# EAGLE design 433_1 (EAGLE 9.2.2)
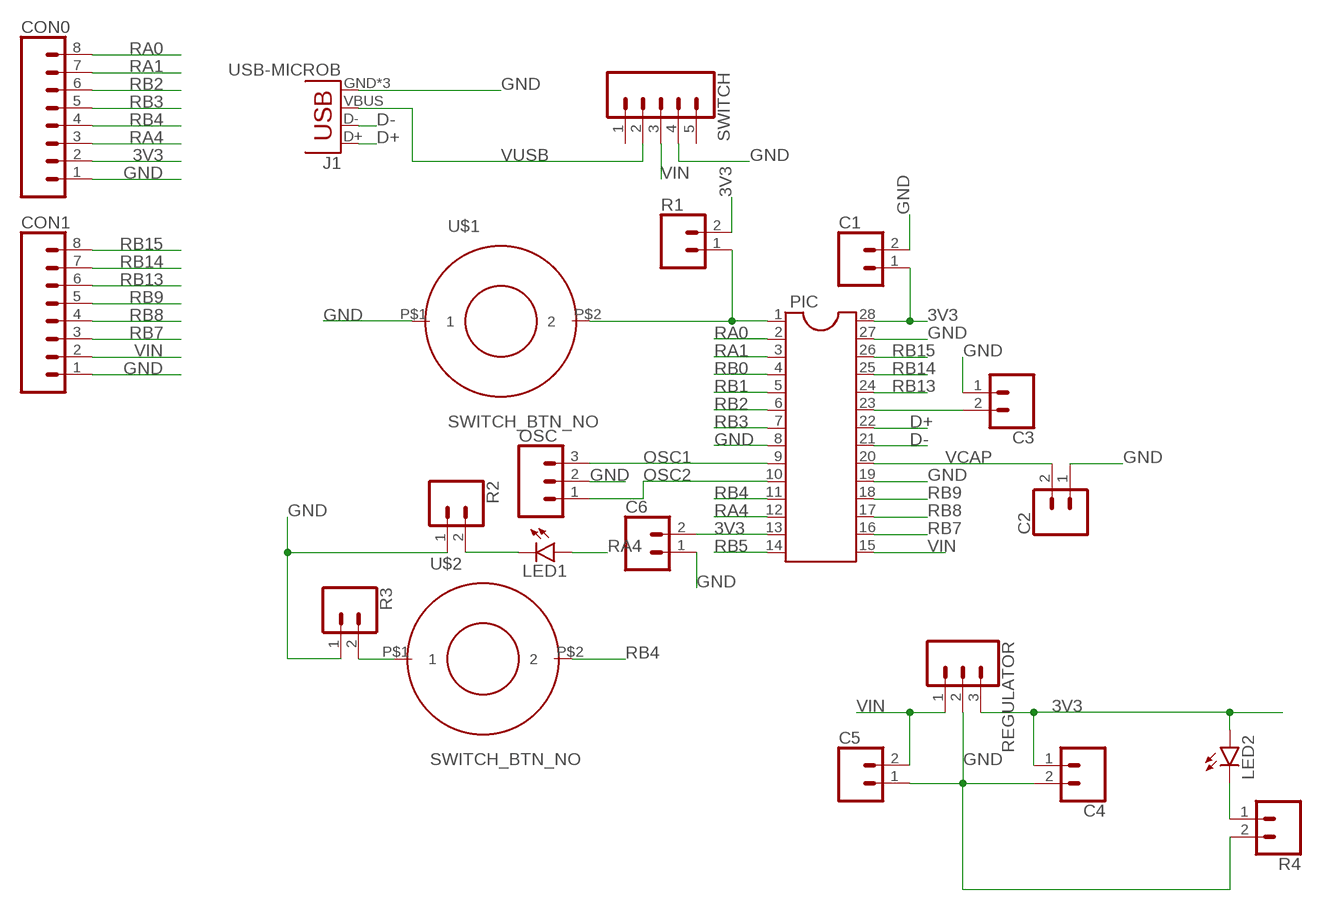
[diagram p0: schematic, sheet 1]

## Parts
C1  CONN_02  [1X02]
C2  CONN_02  [1X02]
C3  CONN_02  [1X02]
C4  CONN_02  [1X02]
C5  CONN_02  [1X02]
C6  CONN_02  [1X02]
CON0  CONN_08"  [1X08]
CON1  CONN_08"  [1X08]
J1  USB-MICROB  [USB-MICROB]
LED1  LED3MM  [LED3MM]
LED2  LED3MM  [LED3MM]
OSC  CONN_03  [1X03]
PIC  DIL28-4  [DIL28-4]
R1  CONN_02  [1X02]
R2  CONN_02  [1X02]
R3  CONN_02  [1X02]
R4  CONN_02  [1X02]
REGULATOR  CONN_03  [1X03]
SWITCH  CONN_05  [1X05]
U$1  SWITCH_BTN_NO  [BTN_2]
U$2  SWITCH_BTN_NO  [BTN_2]

## Nets
3V3: C1.1 C3.2 C4.1 C6.2 CON0.2 LED2.A PIC.13 PIC.23 PIC.28 R1.2 REGULATOR.3
D+: J1.D+ PIC.22
D-: J1.D- PIC.21
GND: C1.2 C2.1 C3.1 C4.2 C5.1 C6.1 CON0.1 CON1.1 J1.GND J1.MT1(GND) J1.MT2(GND) OSC.2 PIC.8 PIC.19 PIC.27 R2.1 R3.1 R4.2 REGULATOR.2 SWITCH.4 U$1.P$1
N$1: LED1.K(C) R2.2
N$2: R3.2 U$2.P$1
N$5: LED2.K(C) R4.1
N$6: PIC.1 R1.1 U$1.P$2
OSC1: OSC.3 PIC.9
OSC2: OSC.1 PIC.10
RA0: CON0.8 PIC.2
RA1: CON0.7 PIC.3
RA4: CON0.3 LED1.A PIC.12
RB0: PIC.4
RB1: PIC.5
RB2: CON0.6 PIC.6
RB3: CON0.5 PIC.7
RB4: CON0.4 PIC.11 U$2.P$2
RB5: PIC.14
RB7: CON1.3 PIC.16
RB8: CON1.4 PIC.17
RB9: CON1.5 PIC.18
RB13: CON1.6 PIC.24
RB14: CON1.7 PIC.25
RB15: CON1.8 PIC.26
VCAP: C2.2 PIC.20
VIN: C5.2 CON1.2 PIC.15 REGULATOR.1 SWITCH.3
VUSB: J1.VBUS SWITCH.2
Unconnected: SWITCH.1 SWITCH.5

## Library data of the parts
C1-C6 R1-R4 = SparkFun-Connectors:CONN_02: Multi connection point. Often used as Generic Header-pin footprint for 0.1 inch spaced/style header connections On any of the 0.1 inch spaced packages, you can populate with these: Break Away Headers - Straight <https://www.sparkfun.com/products/116> (PRT-00116) Break Away Male Headers - Right Angle <https://www.sparkfun.com/products/553> (PRT-00553) Female Headers <https://www.sparkfun.com/products/115> (PRT-00115) Break Away Headers - Machine Pin <https://www.sparkfun.com/products/117> (PRT-00117) Break Away Female Headers - Swiss Machine Pin <https://www.sparkfun.com/products/743> (PRT-00743) For SCREWTERMINALS and SPRING TERMINALS visit here: Screw Terimnals on SparkFun.com <https://www.sparkfun.com/search/results?term=Screw+Terminals> (5mm/3.5mm/2.54mm spacing) This device is also useful as a general connection point to wire up your design to another part of your project. Our various solder wires solder well into these plated through hole pads. Hook-Up Wire - Assortment (Stranded, 22 AWG) <https://www.sparkfun.com/products/11375> (PRT-11375) Hook-Up Wire - Assortment (Solid Core, 22 AWG) <https://www.sparkfun.com/products/11367> (PRT-11367) View the entire wire category on our website here <https://www.sparkfun.com/categories/141> Special notes: Molex polarized connector foot print use with: PRT-08233 with associated crimp pins and housings. 2.54_SCREWTERM for use with PRT-10571. 3.5mm Screw Terminal footprints for PRT-08084 5mm Screw Terminal footprints for use with PRT-08432
CON0 CON1 = SparkFun-Connectors:CONN_08: Multi connection point. Often used as Generic Header-pin footprint for 0.1 inch spaced/style header connections On any of the 0.1 inch spaced packages, you can populate with these: Break Away Headers - Straight <https://www.sparkfun.com/products/116> (PRT-00116) Break Away Male Headers - Right Angle <https://www.sparkfun.com/products/553> (PRT-00553) Female Headers <https://www.sparkfun.com/products/115> (PRT-00115) Break Away Headers - Machine Pin <https://www.sparkfun.com/products/117> (PRT-00117) Break Away Female Headers - Swiss Machine Pin <https://www.sparkfun.com/products/743> (PRT-00743) Arduino Stackable Header - 8 Pin <https://www.sparkfun.com/products/9279> (PRT-09279) For SCREWTERMINALS and SPRING TERMINALS visit here: Screw Terimnals on SparkFun.com <https://www.sparkfun.com/search/results?term=Screw+Terminals> (5mm/3.5mm/2.54mm spacing) This device is also useful as a general connection point to wire up your design to another part of your project. Our various solder wires solder well into these plated through hole pads. Hook-Up Wire - Assortment (Stranded, 22 AWG) <https://www.sparkfun.com/products/11375> (PRT-11375) Hook-Up Wire - Assortment (Solid Core, 22 AWG) <https://www.sparkfun.com/products/11367> (PRT-11367) View the entire wire category on our website here <https://www.sparkfun.com/categories/141> Special notes: Molex polarized connector foot print use with SKU : PRT-08231 with associated crimp pins and housings. 1MM SMD Version SKU: PRT-10208 NOTES ON THE VARIANTS LOCK and LOCK_LONGPADS... This footprint was designed to help hold the alignment of a through-hole component (i.e. 6-pin header) while soldering it into place. You may notice that each hole has been shifted either up or down by 0.005 of an inch from it's more standard position (which is a perfectly straight line). This slight alteration caused the pins (the squares in the middle) to touch the edges of the holes. Because they are alternating, it causes a "brace" to hold the component in place. 0.005 has proven to be the perfect amount of "off-center" position when using our standard breakaway headers. Although looks a little odd when you look at the bare footprint, once you have a header in there, the alteration is very hard to notice. Also,if you push a header all the way into place, it is covered up entirely on the bottom side.; PROD_ID: CONN-08438
J1 = SparkFun-Retired:USB: USB Connectors USB-B-PTH is fully proven SKU : PRT-00139/CONN-08278 USB-miniB is fully proven SKU : PRT-00587 USB-A-PCB is untested. USB-A-H is throughly reviewed, but untested. Spark Fun Electronics SKU : PRT-00437 USB-B-SMT is throughly reviewed, but untested. Needs silkscreen touching up. USB-A-S has not been used/tested USB-MB-H has not been used/tested USB-MICROB has been used. CONN-09505; PROD_ID: CONN-09505
LED1 LED2 = Ilya_Teach:LED: LEDs Standard schematic elements and footprints for 5mm, 3mm, 1206, and 0603 sized LEDs. 5mm - Spark Fun Electronics SKU : COM-00529 (and others)
OSC REGULATOR = SparkFun-Connectors:CONN_03: Multi connection point. Often used as Generic Header-pin footprint for 0.1 inch spaced/style header connections On any of the 0.1 inch spaced packages, you can populate with these: Break Away Headers - Straight <https://www.sparkfun.com/products/116> (PRT-00116) Break Away Male Headers - Right Angle <https://www.sparkfun.com/products/553> (PRT-00553) Female Headers <https://www.sparkfun.com/products/115> (PRT-00115) Break Away Headers - Machine Pin <https://www.sparkfun.com/products/117> (PRT-00117) Break Away Female Headers - Swiss Machine Pin <https://www.sparkfun.com/products/743> (PRT-00743) Stackable Header - 3 Pin (Female, 0.1") <https://www.sparkfun.com/products/13875> (PRT-13875) For SCREWTERMINALS and SPRING TERMINALS visit here: Screw Terimnals on SparkFun.com <https://www.sparkfun.com/search/results?term=Screw+Terminals> (5mm/3.5mm/2.54mm spacing) This device is also useful as a general connection point to wire up your design to another part of your project. Our various solder wires solder well into these plated through hole pads. Hook-Up Wire - Assortment (Stranded, 22 AWG) <https://www.sparkfun.com/products/11375> (PRT-11375) Hook-Up Wire - Assortment (Solid Core, 22 AWG) <https://www.sparkfun.com/products/11367> (PRT-11367) View the entire wire category on our website here <https://www.sparkfun.com/categories/141> Special notes: Molex polarized connector foot print use with SKU : PRT-08232 with associated crimp pins and housings.
PIC = ic-package:DIL28: Dual In Line
SWITCH = SparkFun-Connectors:CONN_05: Multi connection point. Often used as Generic Header-pin footprint for 0.1 inch spaced/style header connections On any of the 0.1 inch spaced packages, you can populate with these: Break Away Headers - Straight <https://www.sparkfun.com/products/116> (PRT-00116) Break Away Male Headers - Right Angle <https://www.sparkfun.com/products/553> (PRT-00553) Female Headers <https://www.sparkfun.com/products/115> (PRT-00115) Break Away Headers - Machine Pin <https://www.sparkfun.com/products/117> (PRT-00117) Break Away Female Headers - Swiss Machine Pin <https://www.sparkfun.com/products/743> (PRT-00743) For SCREWTERMINALS and SPRING TERMINALS visit here: Screw Terimnals on SparkFun.com <https://www.sparkfun.com/search/results?term=Screw+Terminals> (5mm/3.5mm/2.54mm spacing) This device is also useful as a general connection point to wire up your design to another part of your project. Our various solder wires solder well into these plated through hole pads. Hook-Up Wire - Assortment (Stranded, 22 AWG) <https://www.sparkfun.com/products/11375> (PRT-11375) Hook-Up Wire - Assortment (Solid Core, 22 AWG) <https://www.sparkfun.com/products/11367> (PRT-11367) View the entire wire category on our website here <https://www.sparkfun.com/categories/141> Special notes: Molex polarized connector foot print use with SKU : PRT-08231 with associated crimp pins and housings. 1MM SMD Version SKU: PRT-10208
U$1 U$2 = Ilya_Teach:SWITCH_BTN_NO

## Board
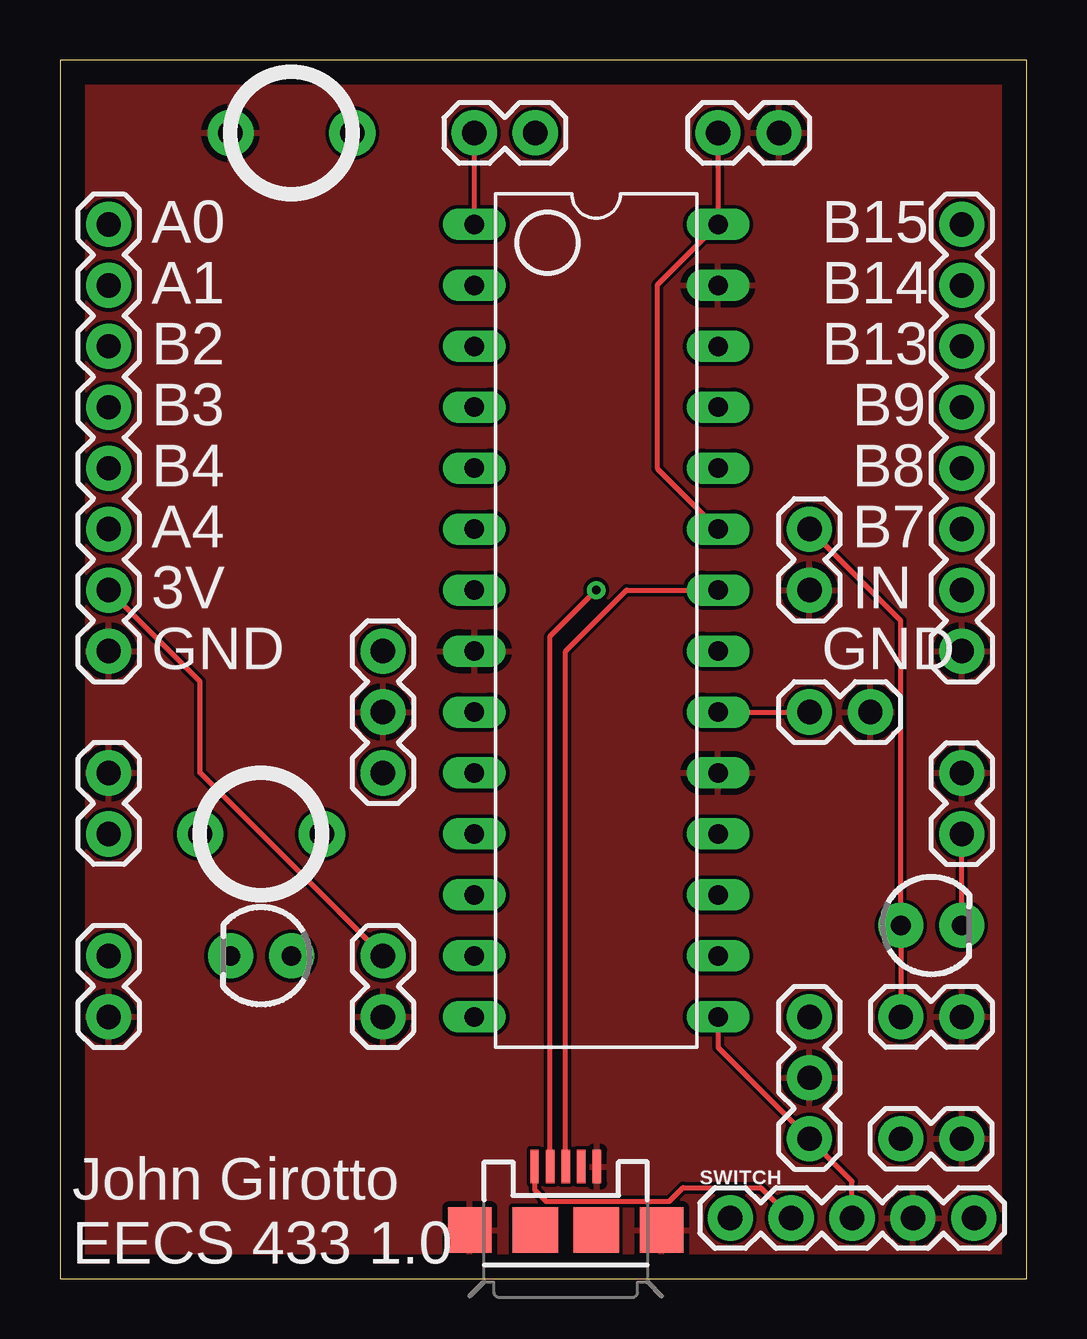
[diagram p1: board, top side]
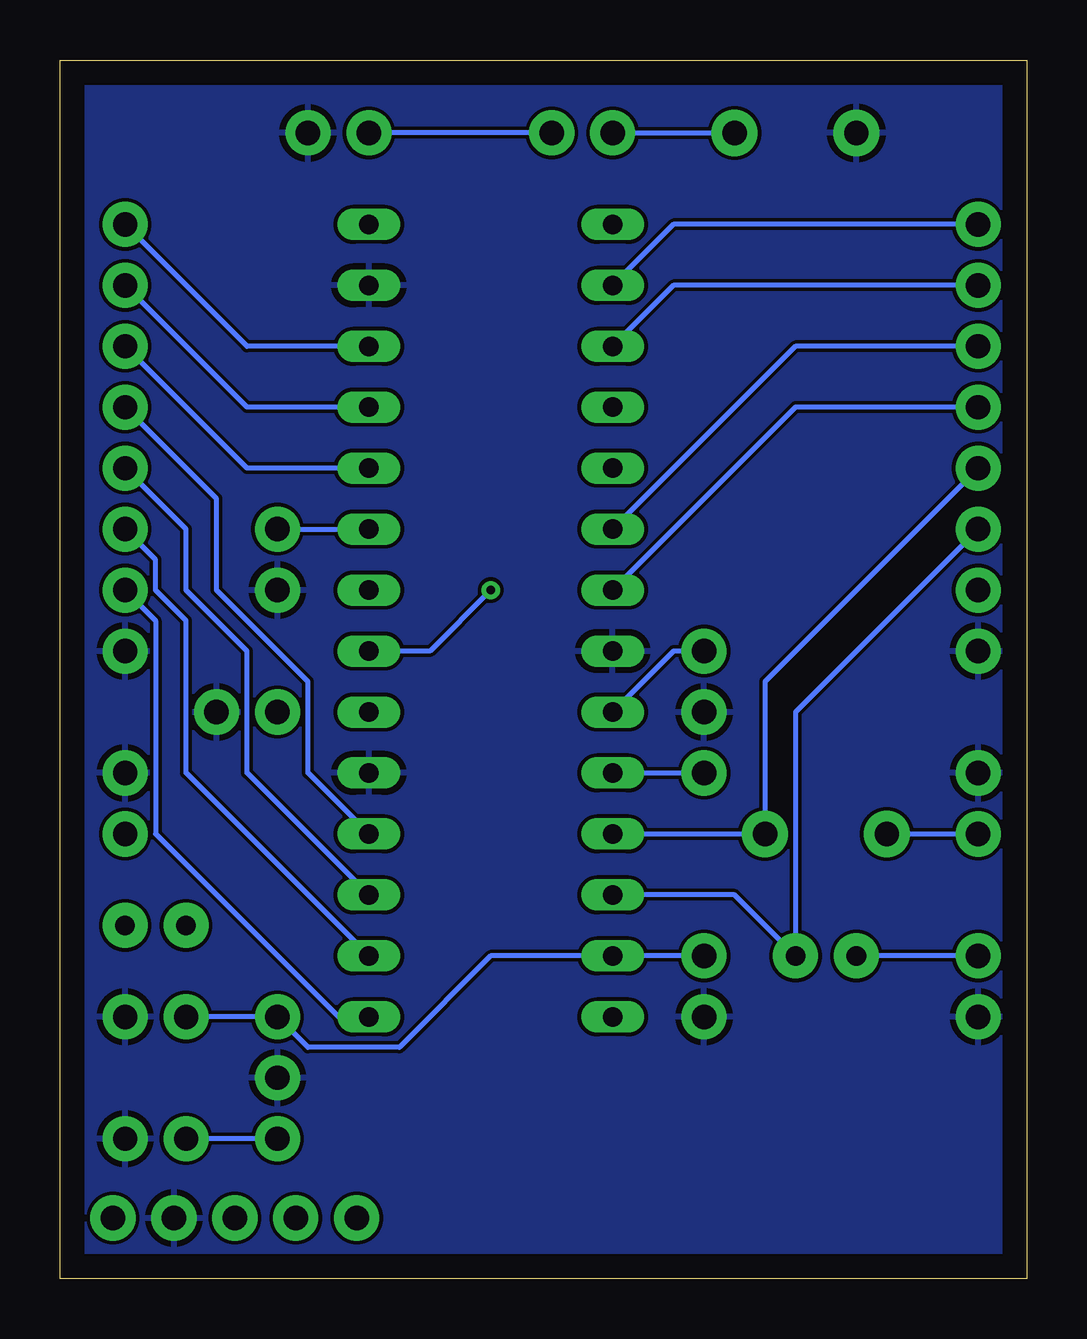
[diagram p2: board, bottom side, seen from below]

Size 40.31 x 50.79 mm. Coordinates in mm from the lower left corner, seen from the top.
Outline: 0,0 40.31,0 40.31,50.79 0,50.79 0,0
Copper layers (1*16): Top 0.035mm / dielectric 1.5mm / Bottom 0.035mm
Design rules "default": minimum track width 6mil, minimum drill 0.35mm, track to track 6mil, track to pad 6mil, pad to pad 6mil, via to via 6mil, smd to smd 6mil, copper to edge 40mil, drill to drill 6mil, minimum pad ring 10mil, minimum via ring 8mil, stop-mask expansion 4mil, vias tented up to drill 0mil, thermal gap 10mil

### Footprints (pad centres in the part's own frame; a part is rotated, then mirrored left to right if it is on the bottom)
1X02 = drill 1.016 pad 1.88: 1 0,0; 2 2.54,0
1X08 = drill 1.016 pad 1.88: 1 0,0; 2 2.54,0; 3 5.08,0; 4 7.62,0; 5 10.16,0; 6 12.7,0; 7 15.24,0; 8 17.78,0
USB-MICROB = smd 0.35 x 1.4: D+ 0,2.65; D- -0.65,2.65; GND 1.3,2.65; ID 0.65,2.65; VBUS -1.3,2.65 | smd 1.8 x 1.9: MT1 -4,0; MT2 4,0 | smd 1.9 x 1.9: P$1 -1.27,0; P$2 1.27,0
LED3MM = drill 0.813 pad 1.88: A -1.27,0; K 1.27,0
1X03 = drill 1.016 pad 1.88: 1 0,0; 2 2.54,0; 3 5.08,0
DIL28-4 = drill 0.813 long: 1 -16.51,-5.08; 2 -13.97,-5.08; 3 -11.43,-5.08; 4 -8.89,-5.08; 5 -6.35,-5.08; 6 -3.81,-5.08; 7 -1.27,-5.08; 8 1.27,-5.08; 9 3.81,-5.08; 10 6.35,-5.08; 11 8.89,-5.08; 12 11.43,-5.08; 13 13.97,-5.08; 14 16.51,-5.08; 15 16.51,5.08; 16 13.97,5.08; 17 11.43,5.08; 18 8.89,5.08; 19 6.35,5.08; 20 3.81,5.08; 21 1.27,5.08; 22 -1.27,5.08; 23 -3.81,5.08; 24 -6.35,5.08; 25 -8.89,5.08; 26 -11.43,5.08; 27 -13.97,5.08; 28 -16.51,5.08
1X05 = drill 1.016 pad 1.88: 1 0,0; 2 2.54,0; 3 5.08,0; 4 7.62,0; 5 10.16,0
BTN_2 = drill 1.016 pad 1.93: P$1 -2.54,0; P$2 2.54,0

### Placement (x,y rotation side)
C1  27.43,47.75 0 top
C2  33.78,23.62 180 top
C3  13.46,10.92 90 top
C4  35.05,10.92 0 top
C5  37.59,5.84 180 top
C6  31.24,28.7 90 top
CON0  2.03,26.16 90 top
CON1  37.59,26.16 90 top
J1  21.08,2.03 0 top
LED1  8.38,13.46 180 top
LED2  36.32,14.73 0 top
OSC  13.46,21.08 90 top
PIC  22.35,27.43 270 top
R1  17.27,47.75 0 top
R2  2.03,10.92 90 top
R3  2.03,21.08 270 top
R4  37.59,18.54 90 top
REGULATOR  31.24,5.84 90 top
SWITCH  27.94,2.54 0 top
U$1  9.65,47.75 0 top
U$2  8.38,18.54 0 top

### Tracks (layer width: path | path; a pad name or v marks a point on that pad's centre or on a via)
3V3
  Top 0.203: C4.1 LED2.A 35.05,27.43 C6.2 | C1.1 PIC.28 24.89,41.4 24.89,33.78 PIC.23 | C3.2 5.84,21.08 5.84,24.89 CON0.2
  Bottom 0.203: C4.1 REGULATOR.3 29.97,9.65 26.16,9.65 22.35,13.46 PIC.13 C3.2 | C6.2 PIC.23 | R1.2 C1.1
D+
  Top 0.203: PIC.22 23.62,28.7 21.08,26.16 J1.D+
D-  (via drill 0.35)
  Top 0.203: J1.D- 20.43,26.78 v22.35,28.7
  Bottom 0.203: v22.35,28.7 24.89,26.16 PIC.21
GND
  pour Top: 0,50.8 40.64,50.8 40.64,0 0,0
  pour Bottom: 0,50.8 40.64,50.8 40.64,0 0,0
N$1
  Bottom 0.203: R2.2 LED1.K
N$2
  Bottom 0.203: U$2.P$1 R3.2
N$5
  Top 0.203: LED2.K R4.1
N$6
  Top 0.203: PIC.1 R1.1
  Bottom 0.203: R1.1 U$1.P$2
OSC1
  Bottom 0.203: OSC.3 14.73,26.16 PIC.9
OSC2
  Bottom 0.203: PIC.10 OSC.1
RA0
  Bottom 0.203: CON0.8 14.73,43.94 PIC.2
RA1
  Bottom 0.203: CON0.7 14.73,41.4 PIC.3
RA4
  Bottom 0.203: PIC.12 12.19,16 LED1.A 9.65,23.62 CON0.3
RB2
  Bottom 0.203: CON0.6 9.65,38.86 PIC.6
RB3
  Bottom 0.203: CON0.5 9.65,36.32 PIC.7
RB4
  Bottom 0.203: PIC.11 U$2.P$2 10.92,24.89 CON0.4
RB7
  Bottom 0.203: PIC.16 35.05,21.08 35.05,27.43 36.32,28.7 36.32,29.97 CON1.3
RB8
  Bottom 0.203: PIC.17 32.51,21.08 32.51,26.16 35.05,28.7 35.05,31.24 CON1.4
RB9
  Bottom 0.203: PIC.18 29.97,21.08 29.97,24.89 33.78,28.7 33.78,32.51 CON1.5
RB13
  Bottom 0.203: PIC.24 32.51,33.78 CON1.6
RB14
  Bottom 0.203: PIC.25 32.51,36.32 CON1.7
RB15
  Bottom 0.203: PIC.26 32.51,38.86 CON1.8
VCAP
  Top 0.203: PIC.20 C2.2
VIN
  Top 0.203: PIC.15 27.43,9.65 30.61,6.48 REGULATOR.1 33.02,4.06 SWITCH.3
  Bottom 0.203: CON1.2 36.32,27.43 36.32,18.54 28.7,10.92 PIC.15 | REGULATOR.1 C5.2
VUSB
  Top 0.203: 19.81,4.65 J1.VBUS 19.78,3.71 20.26,3.24 25.4,3.24 25.97,3.81 29.21,3.81 SWITCH.2

### Text on the board
tPlace: A0 | B15 | A1 | B14 | B2 | B13 | B3 | B9 | B4 | B8 | A4 | B7 | 3V | IN | GND | GND | John Girotto / EECS 433 1.0